# Altium schematic sheet CATS-FAT-Battery-Interface.SchDoc: CATS Pro
size A4; Author: Luca Jost; Revision: 1.0; SheetNumber: 3; SheetTotal: 13; Subtitle: Battery OR Gate
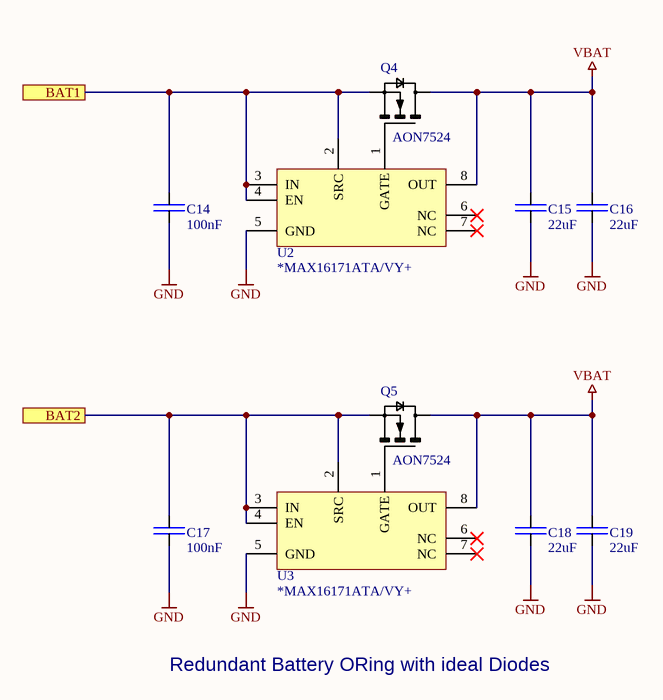
[diagram p0: CATS-FAT-Battery-Interface.SchDoc]

## Parts
C14  100nF  [SMD Keramikkondensator 0603]
C15  22uF  [SMD Keramikkondensator 0805]
C16  22uF  [SMD Keramikkondensator 0805]
C17  100nF  [SMD Keramikkondensator 0603]
C18  22uF  [SMD Keramikkondensator 0805]
C19  22uF  [SMD Keramikkondensator 0805]
Q4  AON7524  [SMD MOSFET DFN 3x3 EP]
Q5  AON7524  [SMD MOSFET DFN 3x3 EP]
U2  *MAX16171ATA/VY+  [SMD IC TDFN-8]
U3  *MAX16171ATA/VY+  [SMD IC TDFN-8]

## Ports
BAT1, BAT2

## Nets
GND: C14.1 C15.1 C16.1 C17.1 C18.1 C19.1 U2.5(GND) U3.5(GND)
VBAT: C15.2 C16.2 C18.2 C19.2 Q4.D Q5.D U2.8(OUT) U3.8(OUT)
BAT1: C14.2 Q4.S U2.2(SRC) U2.3(IN) U2.4(EN) ; port BAT1
BAT2: C17.2 Q5.S U3.2(SRC) U3.3(IN) U3.4(EN) ; port BAT2
NetQ4_G: Q4.G U2.1(GATE)
NetQ5_G: Q5.G U3.1(GATE)

Not connected (* = marked no-connect by the designer): U2 6(NC)* 7(NC)*; U3 6(NC)* 7(NC)*

## Notes on the sheet
- Redundant Battery ORing with ideal Diodes
- Title
- Author:
- Subtitle
- Date:
- Rev:
- CATS
- Sheet
- of
- File:

## Library data of the parts
C14 C17 = E6 - 100nF: SMD Ceramic Capacitor E6; Unit Price: 0.01; Number: -; Supplier: -
C15 C16 C18 C19 = E6 - 22uF: SMD Ceramic Capacitor E6; Unit Price: 0.01; Number: -; Supplier: -
Q4 Q5 = AON7524: N-Channel 30V 25A (Ta), 28A (Tc) 3.1W (Ta), 32W (Tc) Surface Mount 8-DFN (3x3); Item Description: N-Channel MOSFET; Digikey: 785-1634-1-ND; ComponentLink1Description: Datasheet; ComponentLink1URL: http://aosmd.com/res/data_sheets/AON7524.pdf
U2 U3 = MAX16171ATA/VY+: OR Controller N+1 ORing Controller N-Channel 1:1 8-TDFN-CU (2x3); ComponentLink1Description: Datasheet; ComponentLink1URL: https://datasheets.maximintegrated.com/en/ds/MAX16171.pdf; Digikey: 175-MAX16171ATA/VY+-ND